# EAGLE design NAND (EAGLE 7.4.0)
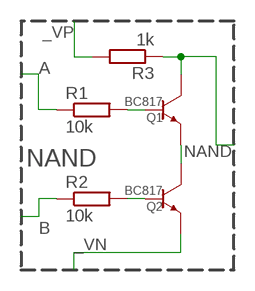
[diagram p0: schematic, sheet 1]

## Parts
Q1  BC817  TRANSISTOR-NPN-GENERICDEFAULT-SOT23-BEC  [SOT23]
Q2  BC817  TRANSISTOR-NPN-GENERICDEFAULT-SOT23-BEC  [SOT23]
R1  10k  R-EU_R0603  [R0603]
R2  10k  R-EU_R0603  [R0603]
R3  1k  R-EU_R0603  [R0603]

## Nets
_VN: Q2.P$2(EMITTER)
_VP: R3.2
A: R1.1
B: R2.1
N$5: Q1.P$1(BASE) R1.2
N$6: Q2.P$1(BASE) R2.2
N$8: Q1.P$2(EMITTER) Q2.P$3(COLLECTOR)
NAND: Q1.P$3(COLLECTOR) R3.1

## Notes on the sheet
- NAND

## Library data of the parts
Q1 Q2 = p.peter-gator:TRANSISTOR-NPN-GENERIC; SV_SPICE_MODEL: NPN (); SV_SPICE_ORDER: COLLECTOR;BASE;EMITTER; SV_SPICE_PREFIX: Q
R1-R3 = p.peter-gator:R-EU_: RESISTOR, European symbol; SV_SPICE_ORDER: 1;2; SV_SPICE_PREFIX: R

## Board
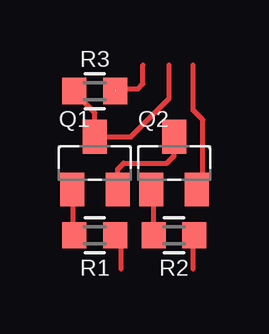
[diagram p1: board, top side]
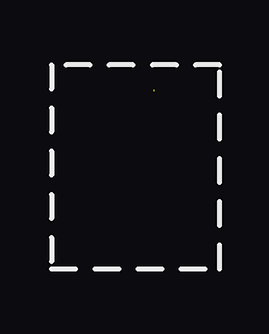
[diagram p2: board, bottom side, seen from below]

No outline drawn. Coordinates in mm, seen from the top.
Copper layers (1*16): Top 0.035mm / dielectric 1.5mm / Bottom 0.035mm
Design rules "Fusion_eagle_rule_v1.1 *": minimum track width 6mil, minimum drill 12mil, track to track 6mil, track to pad 6mil, pad to pad 6mil, via to via 6mil, smd to smd 0mil, copper to edge 10mil, drill to drill 10mil, minimum pad ring 15mil, minimum via ring 6mil, stop-mask expansion 2mil, vias tented up to drill 100mil, thermal gap 10mil

### Footprints (pad centres in the part's own frame; a part is rotated, then mirrored left to right if it is on the bottom)
SOT23 = smd 1 x 1.4: P$1 -0.95,-1.1; P$2 0.95,-1.1; P$3 0,1.1
R0603 = smd 1 x 1.1: 1 -0.85,0; 2 0.85,0

### Placement (x,y rotation side)
Q1  1.9,4.4 0 top
Q2  5.2,4.4 0 top
R1  1.9,1.4 180 top
R2  5.2,1.4 180 top
R3  1.9,7.4 0 top

### Tracks (layer width: path | path; a pad name or v marks a point on that pad's centre or on a via)
_VN
  Top 0.2: 6,8.5 6,6.6 6.4,6.2 6.4,3.8 6.4,3.5 6.2,3.5 6.2,3.3 Q2.P$2
_VP  (1 unrouted)
  Top 0.2: 2.75,7.45 2.8,7.5 3.6,7.5 3.7,7.5 3.9,7.7 3.9,8.5
A
  Top 0.2: 3,0 3,1.35 R1.1
B
  Top 0.2: 6,0 6,1.35 R2.1
N$5
  Top 0.2: R1.2 1.05,1.45 1,1.5 1,3.25 Q1.P$1
N$6
  Top 0.2: R2.2 4.35,3.2 Q2.P$1
N$8
  Top 0.2: Q1.P$2 2.85,4.15 3.1,4.4 4.9,4.4 5.2,4.7 Q2.P$3
NAND
  Top 0.2: R3.1 1.3,7.15 1.3,7.1 1.9,6.5 Q1.P$3 3.4,5.5 5,7.1 5,8.5